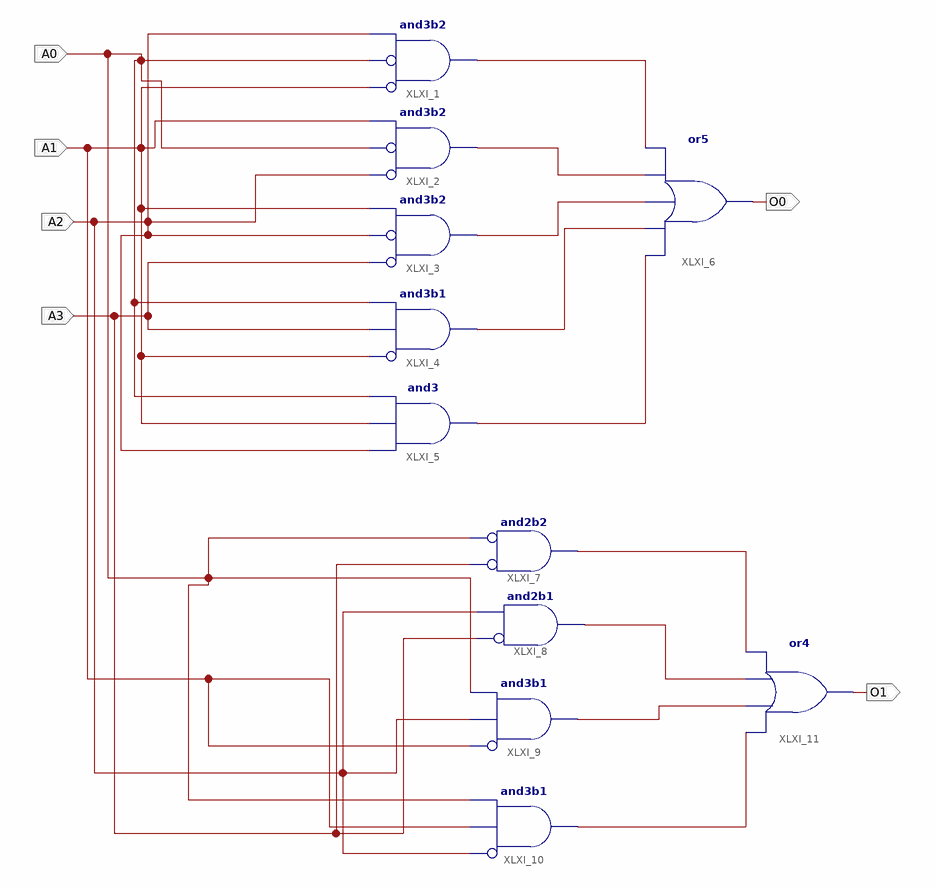
[diagram p0: schematic sheet 1]
// Xilinx ISE schematic S0.sch (xc9500xl) as structural Verilog: 11 symbols, 6 ports
module S0 (
  input  A0,
  input  A3,
  input  A2,
  input  A1,
  output O0,
  output O1
);

  wire XLXN_19, XLXN_20, XLXN_21, XLXN_22, XLXN_23, XLXN_28, XLXN_29, XLXN_30, XLXN_31;

  and XLXI_1 (XLXN_19, ~A1, ~A0, A2);  // and3b2
  and XLXI_2 (XLXN_20, ~A2, ~A0, A1);  // and3b2
  and XLXI_3 (XLXN_21, ~A3, ~A2, A1);  // and3b2
  and XLXI_4 (XLXN_22, ~A1, A3, A0);  // and3b1
  and XLXI_5 (XLXN_23, A2, A1, A0);
  or XLXI_6 (O0, XLXN_23, XLXN_22, XLXN_21, XLXN_20, XLXN_19);
  and XLXI_7 (XLXN_28, ~A3, ~A0);  // and2b2
  and XLXI_8 (XLXN_29, ~A3, A2);  // and2b1
  and XLXI_9 (XLXN_30, ~A1, A2, A0);  // and3b1
  and XLXI_10 (XLXN_31, ~A2, A1, A0);  // and3b1
  or XLXI_11 (O1, XLXN_31, XLXN_30, XLXN_29, XLXN_28);
endmodule
